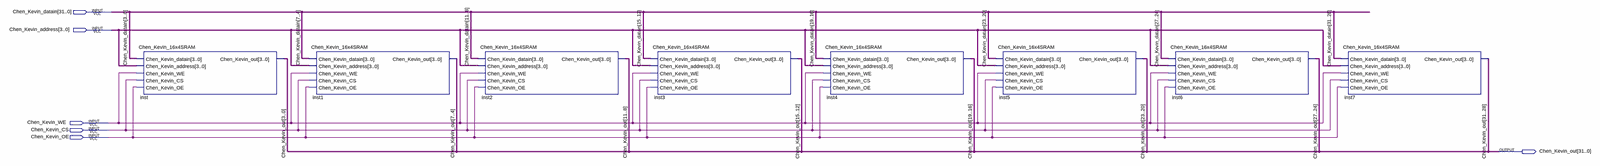
[diagram p0: schematic sheet, whole]
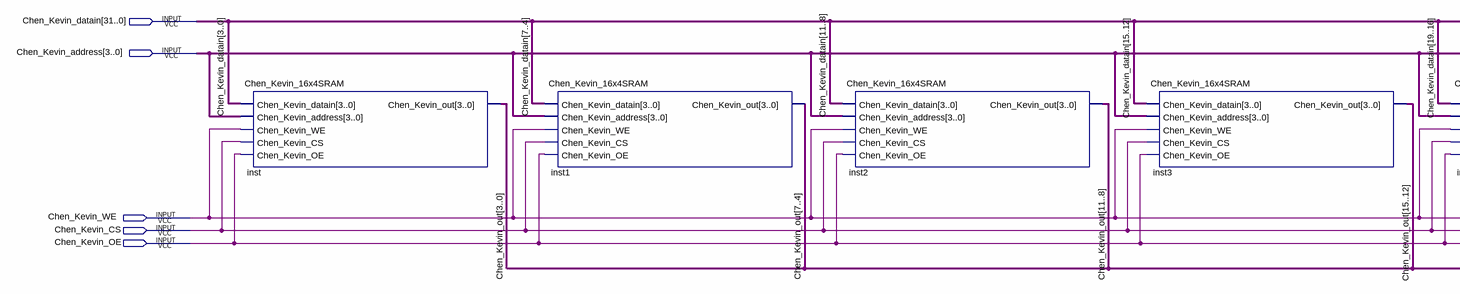
[diagram p1: schematic sheet, left part]
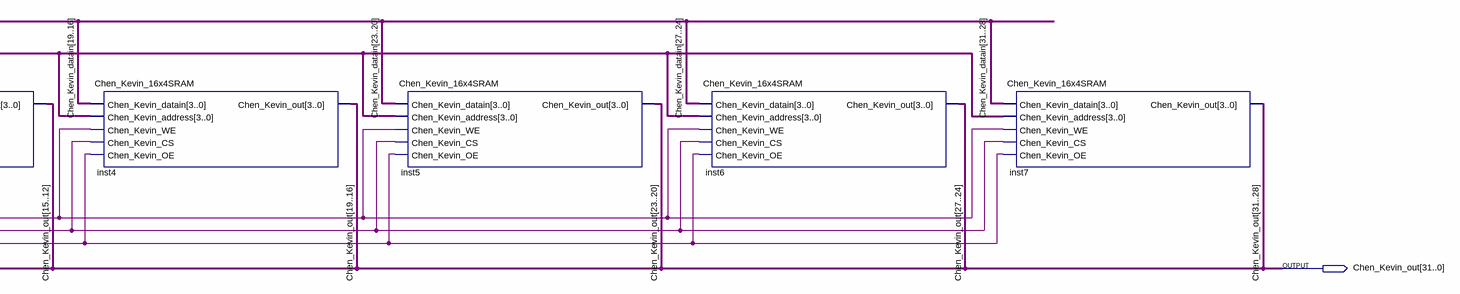
[diagram p2: schematic sheet, right part]
// Quartus schematic Chen_Kevin_16x32SRAM.bdf as structural Verilog: 8 symbols, 6 pins
module Chen_Kevin_16x32SRAM (
  input  [31:0] Chen_Kevin_datain,
  input  [3:0] Chen_Kevin_address,
  input  Chen_Kevin_WE,
  input  Chen_Kevin_CS,
  input  Chen_Kevin_OE,
  output [31:0] Chen_Kevin_out
);

  Chen_Kevin_16x4SRAM inst (
    .Chen_Kevin_datain(Chen_Kevin_datain[3:0]), .Chen_Kevin_address(Chen_Kevin_address),
    .Chen_Kevin_WE(Chen_Kevin_WE), .Chen_Kevin_CS(Chen_Kevin_CS), .Chen_Kevin_OE(Chen_Kevin_OE),
    .Chen_Kevin_out(Chen_Kevin_out[3:0]));
  Chen_Kevin_16x4SRAM inst1 (
    .Chen_Kevin_datain(Chen_Kevin_datain[7:4]), .Chen_Kevin_address(Chen_Kevin_address),
    .Chen_Kevin_WE(Chen_Kevin_WE), .Chen_Kevin_CS(Chen_Kevin_CS), .Chen_Kevin_OE(Chen_Kevin_OE),
    .Chen_Kevin_out(Chen_Kevin_out[7:4]));
  Chen_Kevin_16x4SRAM inst2 (
    .Chen_Kevin_datain(Chen_Kevin_datain[11:8]), .Chen_Kevin_address(Chen_Kevin_address),
    .Chen_Kevin_WE(Chen_Kevin_WE), .Chen_Kevin_CS(Chen_Kevin_CS), .Chen_Kevin_OE(Chen_Kevin_OE),
    .Chen_Kevin_out(Chen_Kevin_out[11:8]));
  Chen_Kevin_16x4SRAM inst3 (
    .Chen_Kevin_datain(Chen_Kevin_datain[15:12]), .Chen_Kevin_address(Chen_Kevin_address),
    .Chen_Kevin_WE(Chen_Kevin_WE), .Chen_Kevin_CS(Chen_Kevin_CS), .Chen_Kevin_OE(Chen_Kevin_OE),
    .Chen_Kevin_out(Chen_Kevin_out[15:12]));
  Chen_Kevin_16x4SRAM inst4 (
    .Chen_Kevin_datain(Chen_Kevin_datain[19:16]), .Chen_Kevin_address(Chen_Kevin_address),
    .Chen_Kevin_WE(Chen_Kevin_WE), .Chen_Kevin_CS(Chen_Kevin_CS), .Chen_Kevin_OE(Chen_Kevin_OE),
    .Chen_Kevin_out(Chen_Kevin_out[19:16]));
  Chen_Kevin_16x4SRAM inst5 (
    .Chen_Kevin_datain(Chen_Kevin_datain[23:20]), .Chen_Kevin_address(Chen_Kevin_address),
    .Chen_Kevin_WE(Chen_Kevin_WE), .Chen_Kevin_CS(Chen_Kevin_CS), .Chen_Kevin_OE(Chen_Kevin_OE),
    .Chen_Kevin_out(Chen_Kevin_out[23:20]));
  Chen_Kevin_16x4SRAM inst6 (
    .Chen_Kevin_datain(Chen_Kevin_datain[27:24]), .Chen_Kevin_address(Chen_Kevin_address),
    .Chen_Kevin_WE(Chen_Kevin_WE), .Chen_Kevin_CS(Chen_Kevin_CS), .Chen_Kevin_OE(Chen_Kevin_OE),
    .Chen_Kevin_out(Chen_Kevin_out[27:24]));
  Chen_Kevin_16x4SRAM inst7 (
    .Chen_Kevin_datain(Chen_Kevin_datain[31:28]), .Chen_Kevin_address(Chen_Kevin_address),
    .Chen_Kevin_WE(Chen_Kevin_WE), .Chen_Kevin_CS(Chen_Kevin_CS), .Chen_Kevin_OE(Chen_Kevin_OE),
    .Chen_Kevin_out(Chen_Kevin_out[31:28]));
endmodule
